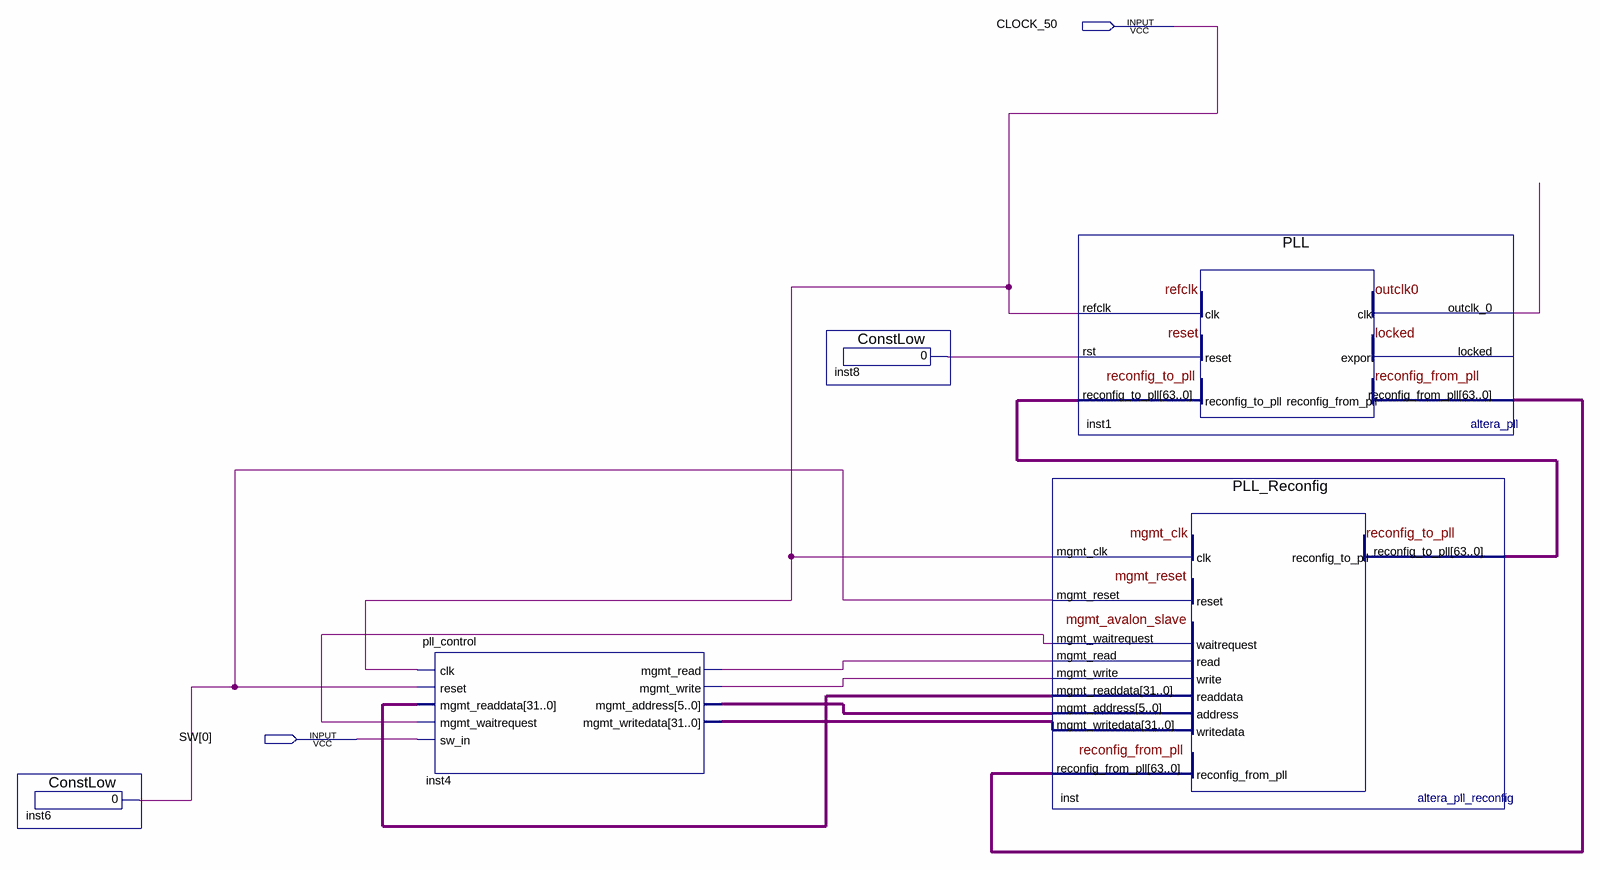
[diagram p0: schematic sheet]
// Quartus schematic Nios_Sys_2A.bdf as structural Verilog: 5 symbols, 2 pins
module Nios_Sys_2A (
  input  CLOCK_50,
  input  [0:0] SW
);

  wire inst1_outclk_0, inst4_mgmt_read, inst4_mgmt_write, inst6_result, inst8_result, inst_mgmt_waitrequest;
  wire [5:0] inst4_mgmt_address;
  wire [31:0] inst4_mgmt_writedata, inst_mgmt_readdata;
  wire [63:0] inst1_reconfig_from_pll, inst_reconfig_to_pll;

  ConstLow inst6 (.result(inst6_result));
  pll_control inst4 (
    .clk(CLOCK_50), .reset(inst6_result), .mgmt_readdata(inst_mgmt_readdata),
    .mgmt_waitrequest(inst_mgmt_waitrequest), .sw_in(SW[0]), .mgmt_read(inst4_mgmt_read),
    .mgmt_write(inst4_mgmt_write), .mgmt_address(inst4_mgmt_address), .mgmt_writedata(inst4_mgmt_writedata));
  ConstLow inst8 (.result(inst8_result));
  PLL_Reconfig inst (
    .mgmt_clk(CLOCK_50), .mgmt_reset(inst6_result), .mgmt_read(inst4_mgmt_read),
    .mgmt_write(inst4_mgmt_write), .mgmt_address(inst4_mgmt_address), .mgmt_writedata(inst4_mgmt_writedata),
    .reconfig_from_pll(inst1_reconfig_from_pll), .mgmt_waitrequest(inst_mgmt_waitrequest),
    .mgmt_readdata(inst_mgmt_readdata), .reconfig_to_pll(inst_reconfig_to_pll));
  PLL inst1 (
    .refclk(CLOCK_50), .rst(inst8_result), .reconfig_to_pll(inst_reconfig_to_pll), .outclk_0(inst1_outclk_0),
    .reconfig_from_pll(inst1_reconfig_from_pll));  // open: locked
endmodule
